# EAGLE design number_1 (EAGLE 6.4)
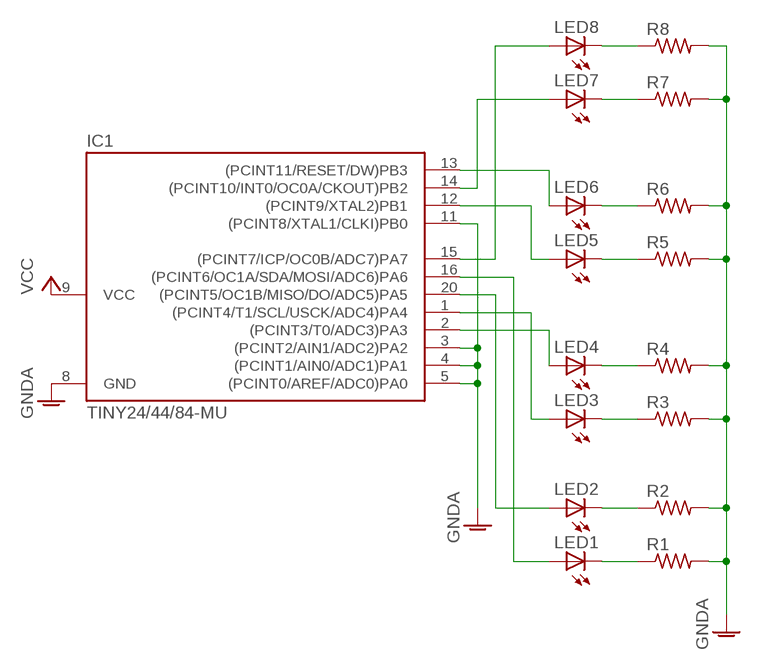
[diagram p0: schematic, sheet 1]

## Parts
IC1  TINY24/44/84-MU  [QFN/MLF20]
LED1  LEDCHIP-LED0603  [CHIP-LED0603]
LED2  LEDCHIP-LED0603  [CHIP-LED0603]
LED3  LEDCHIP-LED0603  [CHIP-LED0603]
LED4  LEDCHIP-LED0603  [CHIP-LED0603]
LED5  LEDCHIP-LED0603  [CHIP-LED0603]
LED6  LEDCHIP-LED0603  [CHIP-LED0603]
LED7  LEDCHIP-LED0603  [CHIP-LED0603]
LED8  LEDCHIP-LED0603  [CHIP-LED0603]
R1  R-US_R0603  [R0603]
R2  R-US_R0603  [R0603]
R3  R-US_R0603  [R0603]
R4  R-US_R0603  [R0603]
R5  R-US_R0603  [R0603]
R6  R-US_R0603  [R0603]
R7  R-US_R0603  [R0603]
R8  R-US_R0603  [R0603]

## Nets
GNDA: IC1.3((PCINT2/AIN1/ADC2)PA2) IC1.4((PCINT1/AIN0/ADC1)PA1) IC1.5((PCINT0/AREF/ADC0)PA0) IC1.8(GND) IC1.11((PCINT8/XTAL1/CLKI)PB0) R1.2 R2.2 R3.2 R4.2 R5.2 R6.2 R7.2 R8.2
N$2: IC1.16((PCINT6/OC1A/SDA/MOSI/ADC6)PA6) LED1.A
N$3: IC1.20((PCINT5/OC1B/MISO/DO/ADC5)PA5) LED2.A
N$4: IC1.1((PCINT4/T1/SCL/USCK/ADC4)PA4) LED3.A
N$5: IC1.2((PCINT3/T0/ADC3)PA3) LED4.A
N$6: IC1.15((PCINT7/ICP/OC0B/ADC7)PA7) LED8.A
N$7: IC1.14((PCINT10/INT0/OC0A/CKOUT)PB2) LED7.A
N$8: IC1.13((PCINT11/RESET/DW)PB3) LED6.A
N$9: IC1.12((PCINT9/XTAL2)PB1) LED5.A
N$10: LED7.C R7.1
N$11: LED8.C R8.1
N$12: LED6.C R6.1
N$13: LED5.C R5.1
N$14: LED4.C R4.1
N$15: LED3.C R3.1
N$16: LED2.C R2.1
N$17: LED1.C R1.1
VCC: IC1.9(VCC)

## Library data of the parts
IC1 = avr-7:TINY24/44/84
LED1-LED8 = led:LED: LED OSRAM: - CHIPLED LG R971, LG N971, LY N971, LG Q971, LY Q971, LO R971, LY R971 LH N974, LH R974 LS Q976, LO Q976, LY Q976 LO Q996 - Hyper CHIPLED LW Q18S LB Q993, LB Q99A, LB R99A - SideLED LS A670, LO A670, LY A670, LG A670, LP A670 LB A673, LV A673, LT A673, LW A673 LH A674 LY A675 LS A676, LA A676, LO A676, LY A676, LW A676 LS A679, LY A679, LG A679 - Hyper Micro SIDELED® LS Y876, LA Y876, LO Y876, LY Y876 LT Y87S - SmartLED LW L88C, LW L88S LB L89C, LB L89S, LG L890 LS L89K, LO L89K, LY L89K LS L896, LA L896, LO L896, LY L896 - TOPLED LS T670, LO T670, LY T670, LG T670, LP T670 LSG T670, LSP T670, LSY T670, LOP T670, LYG T670 LG T671, LOG T671, LSG T671 LB T673, LV T673, LT T673, LW T673 LH T674 LS T676, LA T676, LO T676, LY T676, LB T676, LH T676, LSB T676, LW T676 LB T67C, LV T67C, LT T67C, LS T67K, LO T67K, LY T67K, LW E67C LS E67B, LA E67B, LO E67B, LY E67B, LB E67C, LV E67C, LT E67C LW T67C LS T679, LY T679, LG T679 LS T770, LO T770, LY T770, LG T770, LP T770 LB T773, LV T773, LT T773, LW T773 LH T774 LS E675, LA E675, LY E675, LS T675 LS T776, LA T776, LO T776, LY T776, LB T776 LHGB T686 LT T68C, LB T68C - Hyper Mini TOPLED® LB M676 - Mini TOPLED Santana® LG M470 LS M47K, LO M47K, LY M47K Source: http://www.osram.convergy.de LUXEON: - LUMILED® LXK2-PW12-R00, LXK2-PW12-S00, LXK2-PW14-U00, LXK2-PW14-V00 LXK2-PM12-R00, LXK2-PM12-S00, LXK2-PM14-U00 LXK2-PE12-Q00, LXK2-PE12-R00, LXK2-PE12-S00, LXK2-PE14-T00, LXK2-PE14-U00 LXK2-PB12-K00, LXK2-PB12-L00, LXK2-PB12-M00, LXK2-PB14-N00, LXK2-PB14-P00, LXK2-PB14-Q00 LXK2-PR12-L00, LXK2-PR12-M00, LXK2-PR14-Q00, LXK2-PR14-R00 LXK2-PD12-Q00, LXK2-PD12-R00, LXK2-PD12-S00 LXK2-PH12-R00, LXK2-PH12-S00 LXK2-PL12-P00, LXK2-PL12-Q00, LXK2-PL12-R00 Source: www.luxeon.com KINGBRIGHT: KA-3528ASYC Source: www.kingbright.com
R1-R8 = rcl:R-US_: RESISTOR, American symbol

## Board
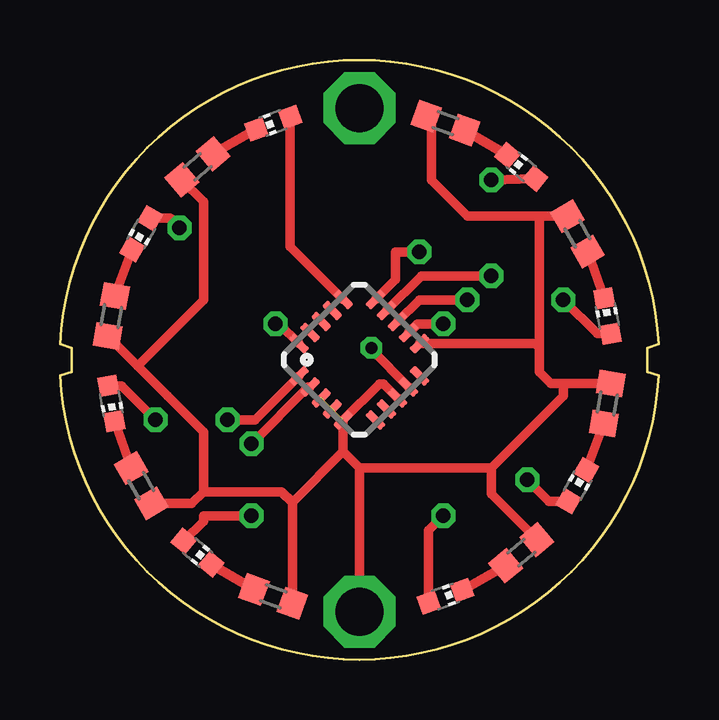
[diagram p1: board, top side]
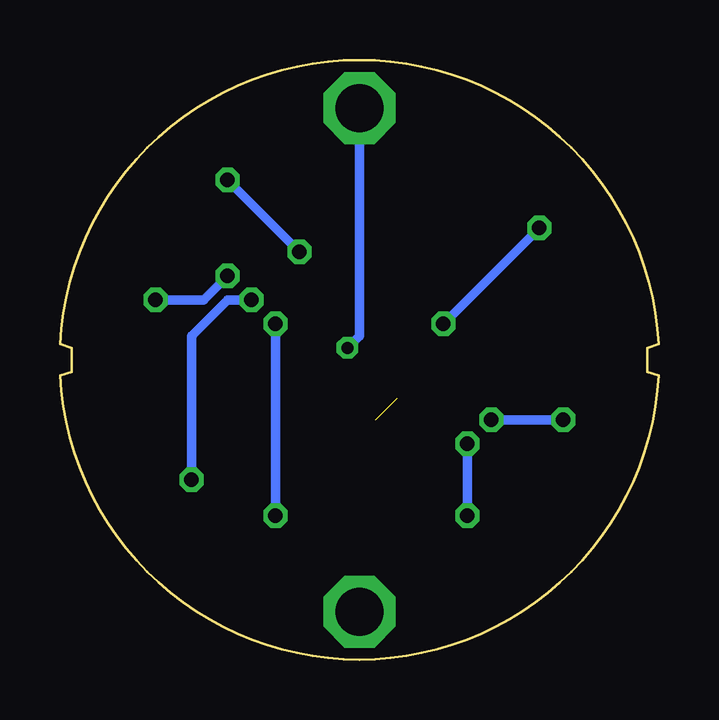
[diagram p2: board, bottom side, seen from below]

Size 24.97 x 25 mm. Coordinates in mm from the lower left corner, seen from the top.
Outline: 24.97,13.15 24.91,13.81 24.83,14.46 24.71,15.1 24.56,15.73 24.37,16.36 24.15,16.98 23.9,17.58 23.62,18.18 23.31,18.75 22.97,19.31 22.6,19.85 22.2,20.37 21.77,20.86 21.32,21.34 20.85,21.79 20.35,22.21 19.83,22.61 19.29,22.98 18.73,23.32 18.16,23.64 17.57,23.92 16.96,24.17 16.35,24.39 15.72,24.57 15.08,24.73 14.44,24.85 13.79,24.93 13.14,24.98 12.48,25 11.83,24.98 11.18,24.93 10.53,24.85 9.88,24.73 9.25,24.57 8.62,24.39 8,24.17 7.4,23.92 6.81,23.64 6.23,23.32 5.67,22.98 5.14,22.61 4.62,22.21 4.12,21.79 3.64,21.34 3.19,20.86 2.77,20.37 2.37,19.85 2,19.31 1.66,18.75 1.34,18.18 1.06,17.58 0.81,16.98 0.59,16.36 0.41,15.73 0.26,15.1 0.14,14.46 0.05,13.81 0,13.15 0.48,13 0.48,12 0,11.85 0.05,11.19 0.14,10.54 0.26,9.9 0.41,9.27 0.59,8.64 0.81,8.02 1.06,7.42 1.34,6.83 1.66,6.25 2,5.69 2.37,5.15 2.77,4.63 3.19,4.14 3.64,3.66 4.12,3.21 4.62,2.79 5.14,2.39 5.67,2.02 6.23,1.68 6.81,1.36 7.4,1.08 8,0.83 8.62,0.61 9.25,0.43 9.88,0.27 10.53,0.15 11.18,0.07 11.83,0.02 12.48,0 13.14,0.02 13.79,0.07 14.44,0.15 15.08,0.27 15.72,0.43 16.35,0.61 16.96,0.83 17.57,1.08 18.16,1.36 18.73,1.68 19.29,2.02 19.83,2.39 20.35,2.79 20.85,3.21 21.32,3.66 21.77,4.14 22.2,4.63 22.6,5.15 22.97,5.69 23.31,6.25 23.62,6.83 23.9,7.42 24.15,8.02 24.37,8.64 24.56,9.27 24.71,9.9 24.83,10.54 24.91,11.19 24.97,11.85 24.48,12 24.48,13 24.97,13.15
Copper layers (1*16): Top 0.035mm / dielectric 1.5mm / Bottom 0.035mm
Design rules "default *": minimum track width 15mil, minimum drill 24mil, track to track 10mil, track to pad 10mil, pad to pad 10mil, via to via 10mil, smd to smd 10mil, copper to edge 20mil, drill to drill 8mil, minimum pad ring 10mil, minimum via ring 8mil, stop-mask expansion 4mil, vias tented up to drill 0mil, thermal gap 10mil

### Footprints (pad centres in the part's own frame; a part is rotated, then mirrored left to right if it is on the bottom)
QFN/MLF20 = smd 0.9 x 0.35: 1 -2.25,1.3; 2 -2.25,0.65; 3 -2.25,0; 4 -2.25,-0.65; 5 -2.25,-1.3; 11 2.25,-1.3; 12 2.25,-0.65; 13 2.25,0; 14 2.25,0.65; 15 2.25,1.3 | smd 0.35 x 0.9: 6 -1.3,-2.25; 7 -0.65,-2.25; 8 0,-2.25; 9 0.65,-2.25; 10 1.3,-2.25; 16 1.3,2.25; 17 0.65,2.25; 18 0,2.25; 19 -0.65,2.25; 20 -1.3,2.25
CHIP-LED0603 = smd 0.8 x 0.8: A 0,-0.75; C 0,0.75
R0603 = smd 1 x 1.1: 1 -0.85,0; 2 0.85,0

### Placement (x,y rotation side)
IC1  12.48,12.5 45 top
LED1  8.89,22.37 110 top
LED2  3.39,17.75 150 top
LED3  2.14,10.68 190 top
LED4  5.73,4.46 230 top
LED5  16.07,2.63 290 top
LED6  21.58,7.25 330 top
LED7  22.82,14.32 10 top
LED8  19.23,20.54 50 top
R1  5.73,20.54 220 top
R2  2.14,14.32 260 top
R3  3.39,7.25 300 top
R4  8.89,2.63 340 top
R5  19.23,4.46 40 top
R6  22.82,10.68 80 top
R7  21.58,17.75 120 top
R8  16.07,22.37 160 top

### Tracks (layer width: path | path; a pad name or v marks a point on that pad's centre or on a via)
GNDA  (via drill 2)  (2 unrouted)
  Top 0.4: 11.81,8.67 IC1.5 13.32,11.5 13.48,11.5 IC1.8 | 11.81,8.67 12.48,8 | 12.48,8 v12.48,2 | R7.2 19.98,18.49 | 19.98,18.49 17,18.49 15.48,20 15.48,22.45 R8.2 | R6.2 20.98,11.51 | 20.98,11.51 20.47,11.51 19.98,12 19.98,13 | 19.98,13 19.98,18.49 | R5.2 17.98,6.9 17.98,8 | 17.98,8 20.98,11 20.98,11.51 | IC1.8 | 17.98,8 12.48,8 | R4.2 9.69,6.55 | 9.69,6.55 11.81,8.67 | 9.69,6.55 9.24,7 5.98,7 | 5.98,7 5.5,6.51 R3.2 | R2.2 3.23,12.25 | 3.23,12.25 4.48,11 5.98,9.5 5.98,7 | R1.2 5.98,19.1 5.98,15 3.23,12.25 | IC1.11 19.81,13.17 19.98,13
N$2
  Top 0.4: LED1.A 9.6,17.23 IC1.16
N$3  (via drill 0.6)
  Top 0.4: LED2.A 4.58,18.4 v4.98,18 | v8.98,14 9.14,14 IC1.20
  Bottom 0.4: v4.98,18 v8.98,14
N$4  (via drill 0.6)
  Top 0.4: LED3.A 2.57,11.41 v3.98,10 | v6.98,10 8.14,10 IC1.1
  Bottom 0.4: v3.98,10 v6.98,10
N$5  (via drill 0.6)
  Top 0.4: IC1.2 10.35,11.37 v7.98,9 | v7.98,6 5.98,6 5.98,5.76 LED4.A
  Bottom 0.4: v7.98,9 v7.98,6
N$6  (via drill 0.6)
  Top 0.4: LED8.A v17.98,20 | v14.98,17 13.98,17 13.98,15.84 IC1.15
  Bottom 0.4: v17.98,20 v14.98,17
N$7  (via drill 0.6)
  Top 0.4: LED7.A 22.4,13.59 v20.98,15 | v17.98,16 15.06,16 IC1.14
  Bottom 0.4: v20.98,15 18.98,15 v17.98,16
N$8  (via drill 0.6)
  Top 0.4: LED6.A 20.38,6.6 v19.48,7.5 | v16.98,15 14.98,15 IC1.13
  Bottom 0.4: v19.48,7.5 19.48,13.5 17.98,15 v16.98,15
N$9  (via drill 0.6)
  Top 0.4: LED5.A 15.37,5.39 v15.98,6 | v15.98,14 14.9,14 IC1.12
  Bottom 0.4: v15.98,6 v15.98,14
N$10
  Top 0.4: LED7.C R7.1
N$11
  Top 0.4: LED8.C R8.1
N$12
  Top 0.4: LED6.C R6.1
N$13
  Top 0.4: LED5.C R5.1
N$14
  Top 0.4: LED4.C R4.1
N$15
  Top 0.4: LED3.C R3.1
N$16
  Top 0.4: LED2.C R2.1
N$17
  Top 0.4: R1.1 LED1.C
VCC  (via drill 0.5, 2)
  Top 0.4: v12.98,13 12.98,12.92 IC1.9
  Bottom 0.4: v12.48,23 12.48,13.5 v12.98,13